# EasyEDA schematic SCH_Argon flow controller_2021-09-10.json
TITLE: TIG Trigger Interceptor; REV: 1.0; Date: 2021-09-09; Sheet: 1/1; Drawn By: Gene Selkov; Company: Random Ends Fabrication
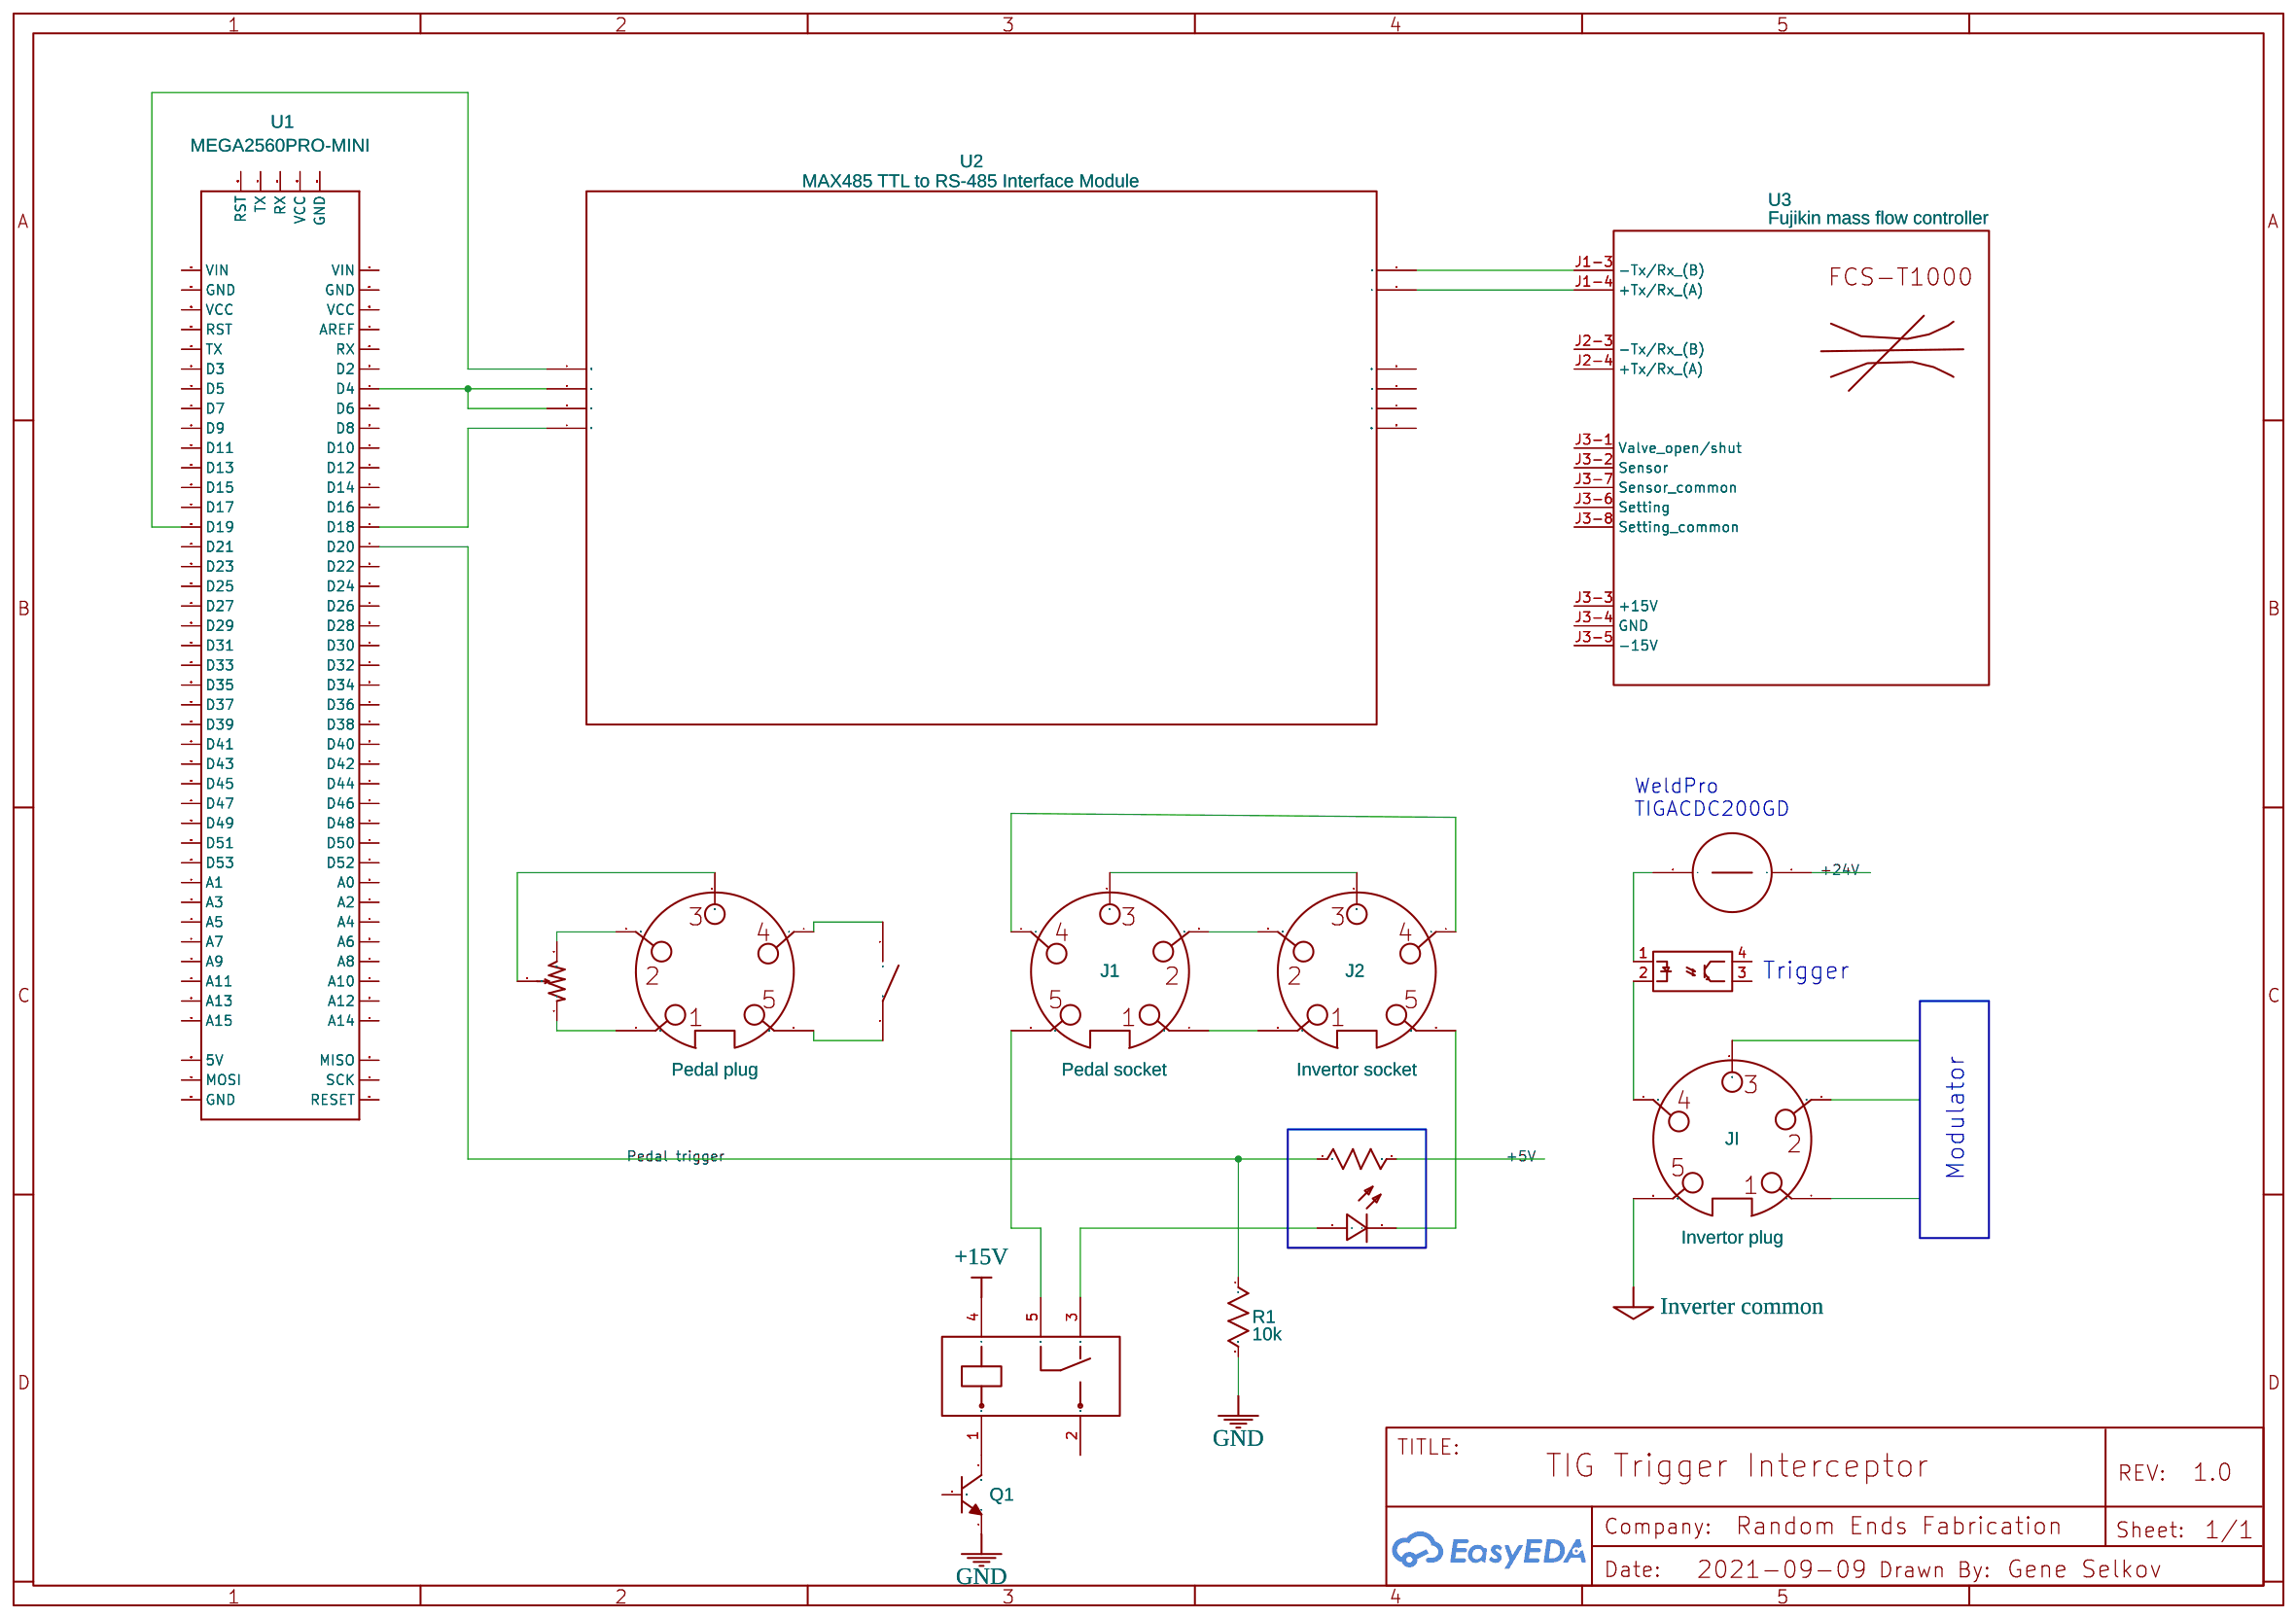
[diagram p0: schematic sheet]

## Parts
CS  Current source
IC1  Trigger  [&#126;]
J0  Pedal plug
J1  Pedal socket
J2  Invertor socket
JI  Invertor plug
LED1  LED-Red(0805)  [LED-0805]
PHR  1 .. 40k  [R0603]
POT  POTENTIOMETER  [MONOPOT]
Q1  MPSA06-AT/P  [TO-92-3_L4.8-W3.7-P2.54-L]
R1  10k  [R0603]
RELAY1  SRD-12VDC-SL-C  [RELAY-TH_SRD-XXVDC-XL-C]
S1  Switch
U1  MEGA2560PRO-MINI  [MEGA2560PRO-MINI]
U2  MAX485 TTL to RS-485 Interface Module
U3  Fujikin mass flow controller

## Library data of the parts
CS = Current source: Manufacturer: N/A; Manufacturer Part: N/A; Supplier Part: N/A; link: https://en.wikipedia.org/wiki/Current_source; Contributor: Gene Selkov
IC1 = Optocoupler_SMD_KPC357_LTV35x_PC357_SingleChannel: Contributor: KiCAD; license: https://www.gnu.org/licenses/lgpl-2.1.html
J0-J2 JI = Weipu 5 connector: Manufacturer: Unknown; Manufacturer Part: Unknown; Supplier: MDFLY Electronics; Supplier Part: CON-HK1705; link: https://www.mdfly.com/products/hq-5-contacts-5-pin-aviation-plug-connector-m16mf-panel-mount-male-pin.html; Contributor: selkovjr
LED1 = LED-Red(0805): Supplier: LCSC; Manufacturer: Everlight Elec; Manufacturer Part: 17-21SURC/S530-A2/TR8; Supplier Part: C131244
PHR R1 = R_0603_US: Contributor: LCEDA_Lib
POT = POTENTIOMETER: Contributor: ThaiKy; sourceId: ElVTfdzVS
Q1 = MPSA06-AT/P: Supplier: LCSC; Manufacturer: KEC; Contributor: LCSC; Supplier Part: C112894; JLCPCB Part Class: Extended Part
RELAY1 = SRD-12VDC-SL-C: Supplier: LCSC; Manufacturer: SONGLE; Supplier Part: C30431; JLCPCB Part Class: Extended Part
S1 = Switch: Contributor: aschwaj
U1 = MEGA2560PRO-MINI: Contributor: Mathias Niedermiaer
U2 = MAX485 TTL to RS-485 Interface Module: Manufacturer: Uknown; Supplier: e-Gizmo Mechatronix Central; link: https://e-gizmo.net/oc/kits%20documents/MAX485%20Module%205V%20TTL/MAX485%20Module%205V%20logic%20TTL%20to%20RS-485.pdf; Contributor: Gene Selkov
U3 = Fujikin mass flow controller: Manufacturer: Fujikin; Manufacturer Part: FCS-T1000; Supplier: Fujikin; Supplier Part: FCS-T1000; link: https://www.fujikin.co.jp/support/pdf/751-01_fcs_thermal_eng.pdf; Contributor: Gene Selkov

## Nets
+5V: PHR.2
+15V: RELAY1.4
+24V: CS.1(+)
GND: Q1.1(E) R1.2
Inverter common: JI.5
Pedal trigger: PHR.1 R1.1 U1.D20
Net-(CS-2): CS.2(-) IC1.1
Net-(IC1-2): IC1.2 JI.4
Net-(J0-1): J0.1 POT.1
Net-(J0-2): J0.2 POT.2
Net-(J0-3): J0.3 POT.3
Net-(J0-4): J0.4 S1.1
Net-(J0-5): J0.5 S1.2
Net-(J1-1): J1.1 J2.1
Net-(J1-2): J1.2 J2.2
Net-(J1-3): J1.3 J2.3
Net-(J1-4): J1.4 J2.4
Net-(J1-5): J1.5 RELAY1.5
Net-(J2-5): J2.5 LED1.2(-)
Net-(LED1-1): LED1.1(+) RELAY1.3
Net-(Q1-3): Q1.3(C) RELAY1.1
Net-(U1-D4): U1.D4 U2.2(RE) U2.3(DE)
Net-(U1-D18): U1.D18 U2.4(DI)
Net-(U1-D19): U1.D19 U2.1(RO)
Net-(U2-9): U2.9(B) U3.J1-3(-Tx/Rx (B))
Net-(U2-10): U2.10(A) U3.J1-4(+Tx/Rx (A))

Not connected (* = marked no-connect by the designer): IC1 3 4; JI 1 2 3; Q1 2(B); RELAY1 2; U1 5V@3(5V) A0 A1 A2 A3 A4 A5 A6 A7 A8 A9 A10 A11 A12 A13 A14 A15 AREF D2 D3 D5 D6 D7 D8 D9 D10 D11 D12 D13 D14 D15 D16 D17 D21 D22 D23 D24 D25 D26 D27 D28 D29 D30 D31 D32 D33 D34 D35 D36 D37 D38 D39 D40 D41 D42 D43 D44 D45 D46 D47 D48 D49 D50 D51 D52 D53 GND@1(GND) GND@2(GND) GND@3(GND) GND@4(GND) MISO MOSI RESET RST@1(RST) RST@2(RST) RX@1(RX) RX@2(RX) SCK TX@1(TX) TX@2(TX) VCC@1(VCC) VCC@2(VCC) VCC@3(VCC) VIN@1(VIN) VIN@2(VIN); U2 5(5V) 6(B) 7(A) 8(GND); U3 J2-3(-Tx/Rx (B)) J2-4(+Tx/Rx (A)) J3-1(Valve open/shut) J3-2(Sensor) J3-3(+15V) J3-4(GND) J3-5(-15V) J3-6(Setting) J3-7(Sensor common) J3-8(Setting common)

## Notes on the sheet
- WeldPro
  TIGACDC200GD
- Trigger
- Modulator
